# Altium schematic sheet INVERTER (2).SchDoc
size A4
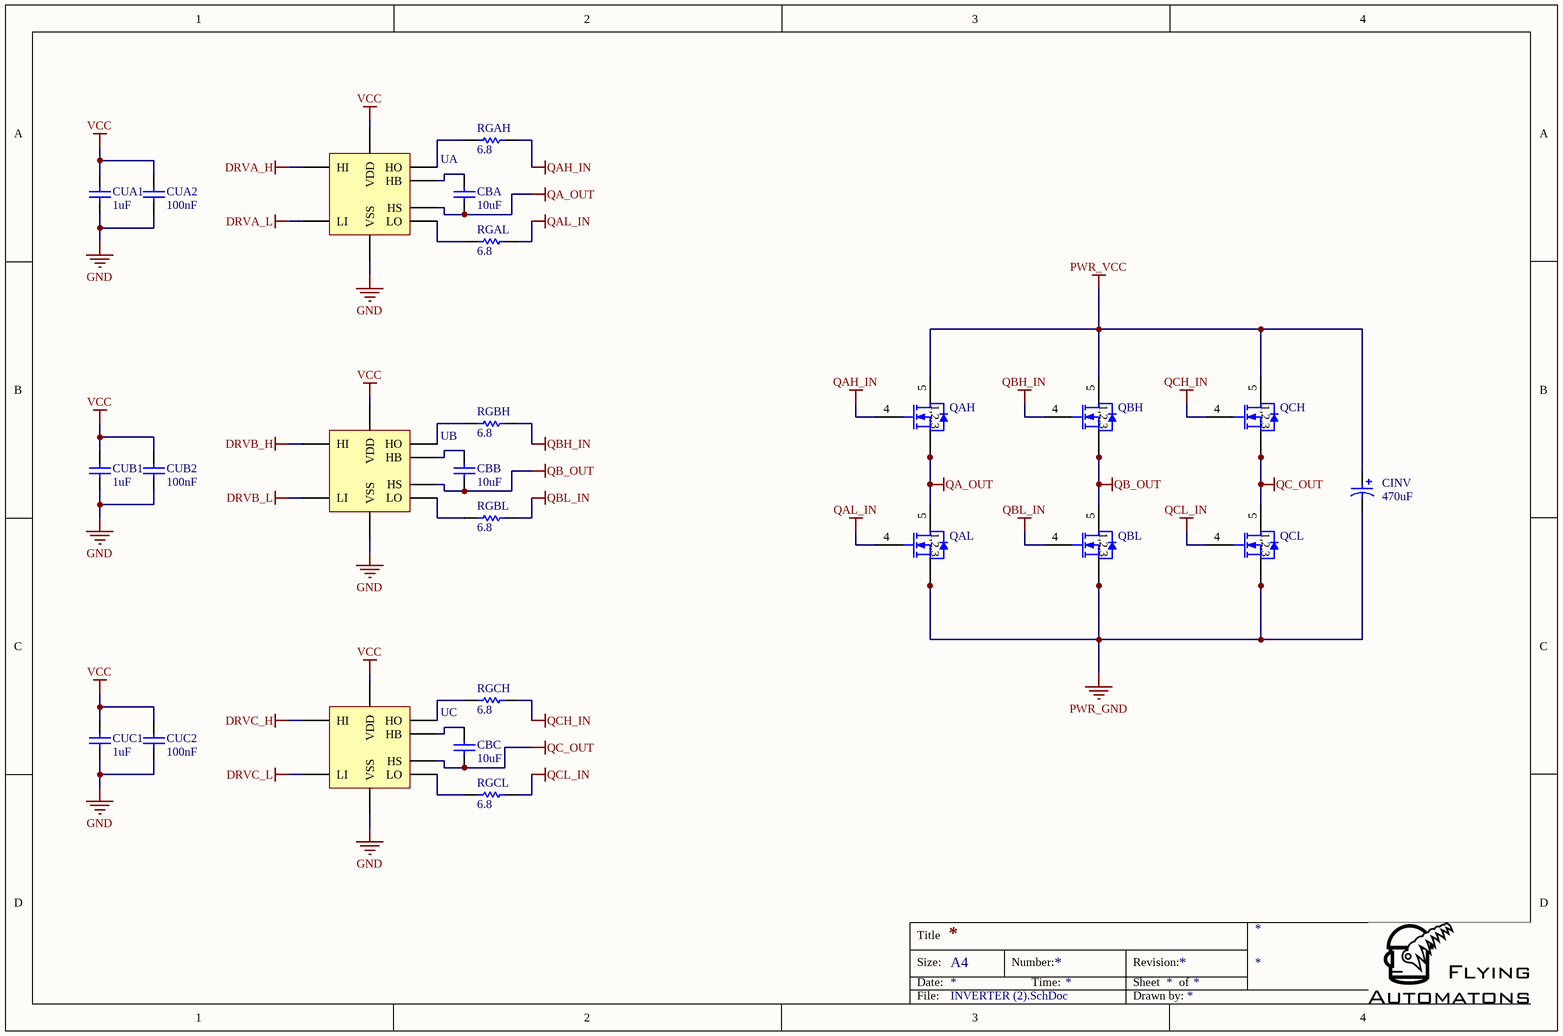
[diagram p0: INVERTER (2).SchDoc]

## Parts
CBA  10uF  [CAPC3216L]
CBB  10uF  [CAPC3216L]
CBC  10uF  [CAPC3216L]
CINV  470uF  [CAP_RADIAL-CAN_SMD_M10]
CUA1  1uF  [CAPC1608L]
CUA2  100nF  [CAPC1608L]
CUB1  1uF  [CAPC1608L]
CUB2  100nF  [CAPC1608L]
CUC1  1uF  [CAPC1608L]
CUC2  100nF  [CAPC1608L]
QAH  (no value)  [x-NXP_LFPAK33]
QAL  (no value)  [x-NXP_LFPAK33]
QBH  (no value)  [x-NXP_LFPAK33]
QBL  (no value)  [x-NXP_LFPAK33]
QCH  (no value)  [x-NXP_LFPAK33]
QCL  (no value)  [x-NXP_LFPAK33]
RGAH  6.8  [RESC1608L]
RGAL  6.8  [RESC1608L]
RGBH  6.8  [RESC1608L]
RGBL  6.8  [RESC1608L]
RGCH  6.8  [RESC1608L]
RGCL  6.8  [RESC1608L]
UA  UCC27201A  [x-TI_S-PVSON-N9]  (value not drawn)
UB  UCC27201A  [x-TI_S-PVSON-N9]  (value not drawn)
UC  UCC27201A  [x-TI_S-PVSON-N9]  (value not drawn)

## Nets
DRVA_H: UA.6(HI)
DRVA_L: UA.7(LI)
DRVB_H: UB.6(HI)
DRVB_L: UB.7(LI)
DRVC_H: UC.6(HI)
DRVC_L: UC.7(LI)
GND: CUA1.2 CUA2.2 CUB1.2 CUB2.2 CUC1.2 CUC2.2 UA.8(VSS) UB.8(VSS) UC.8(VSS)
PWR_GND: CINV.2 QAL.1(S) QAL.2(S) QAL.3(S) QBL.1(S) QBL.2(S) QBL.3(S) QCL.1(S) QCL.2(S) QCL.3(S)
PWR_VCC: CINV.1 QAH.5(D) QBH.5(D) QCH.5(D)
QA_OUT: CBA.2 QAH.1(S) QAH.2(S) QAH.3(S) QAL.5(D) UA.4(HS)
QAH_IN: QAH.4(G) RGAH.1
QAL_IN: QAL.4(G) RGAL.1
QB_OUT: CBB.2 QBH.1(S) QBH.2(S) QBH.3(S) QBL.5(D) UB.4(HS)
QBH_IN: QBH.4(G) RGBH.1
QBL_IN: QBL.4(G) RGBL.1
QC_OUT: CBC.2 QCH.1(S) QCH.2(S) QCH.3(S) QCL.5(D) UC.4(HS)
QCH_IN: QCH.4(G) RGCH.1
QCL_IN: QCL.4(G) RGCL.1
VCC: CUA1.1 CUA2.1 CUB1.1 CUB2.1 CUC1.1 CUC2.1 UA.1(VDD) UB.1(VDD) UC.1(VDD)
NetCBA_1: CBA.1 UA.2(HB)
NetCBB_1: CBB.1 UB.2(HB)
NetCBC_1: CBC.1 UC.2(HB)
NetRGAH_2: RGAH.2 UA.3(HO)
NetRGAL_2: RGAL.2 UA.9(LO)
NetRGBH_2: RGBH.2 UB.3(HO)
NetRGBL_2: RGBL.2 UB.9(LO)
NetRGCH_2: RGCH.2 UC.3(HO)
NetRGCL_2: RGCL.2 UC.9(LO)

## Notes on the sheet
- Title
- Size:
- Date:
- A4
- Number:
- Time:
- Revision:
- Sheet
- of
- File:
- Drawn by:
- (in symbol PSMN9R0-25MLC) 1,2,3

## Library data of the parts
CBA CBB CBC = CAP_10u_1206_25V_Y5V: CAP CER 10UF 25V Y5V 1206; Manufacturer Part Number: TMK316F106ZL-T; Name: CAP_10u_1206_25V_Y5V; Value: 10uF; Supplier 1: Digi-Key; Supplier Part Number 1: 587-1353-1-ND
CINV = CAP_E_470u_Dia10_25V_Al_20%: CAP ALUM 470UF 25V 20% SMD; Manufacturer: Nichicon; Manufacturer Part Number: UCW1E471MNL1GS; Name: CAP_E_470u_Dia10_25V_Al_20%; Value: 470uF; Supplier 1: Digi-Key; Supplier Part Number 1: 493-9424-1-ND
CUA1 CUB1 CUC1 = CAP_1u_0603_25V_X5R_10%: CAP CER 1UF 25V 10% X5R 0603; Manufacturer Part Number: TMK107BJ105KA-T; Name: CAP_1u_0603_25V_X5R_10%; Value: 1uF; Supplier 1: Digi-Key; Supplier Part Number 1: 587-1248-1-ND
CUA2 CUB2 CUC2 = CAP_100n_0603_50V_Y5V: CAP CER 0.1UF 50V Y5V 0603; Manufacturer Part Number: CC0603ZRY5V9BB104; Name: CAP_100n_0603_50V_Y5V; Value: 100nF; Supplier 1: Digi-Key; Supplier Part Number 1: 311-1343-1-ND
QAH QAL QBH QBL QCH QCL = PSMN9R0-25MLC: TRANSISTOR MOSFET N-CHANN 25V 8.6MOHM; Manufacturer: NXP Semiconductors; Manufacturer Part Number: PSMN9R0-25MLC,115; Name: PSMN9R0-25MLC; Value: PSMN9R0-25MLC; Supplier 1: Digi-Key; Supplier Part Number 1: 568-9578-1-ND
RGAH RGAL RGBH RGBL RGCH RGCL = RES_6R8_0603_0W1_1%: RES 6.8 OHM 1/10W 1% 0603; Manufacturer: Stackpole Electronics Inc; Manufacturer Part Number: RMCF0603FT6R80; Name: RES_6R8_0603_0W1_1%; Value: 6.8; Supplier 1: Digi-Key; Supplier Part Number 1: RMCF0603FT6R80CT-ND
UA UB UC = x-TI_UCC27201A: IC DVR HIGH/LOW SIDE 3A 9SON; Manufacturer: Texas Instruments; Manufacturer Part Number: UCC27201ADRCT; Name: x-TI_UCC27201A; Supplier 1: Digi-Key; Supplier Part Number 1: 296-30051-2-ND